# EAGLE schematic ne555n-astable (EAGLE 9.6.2)
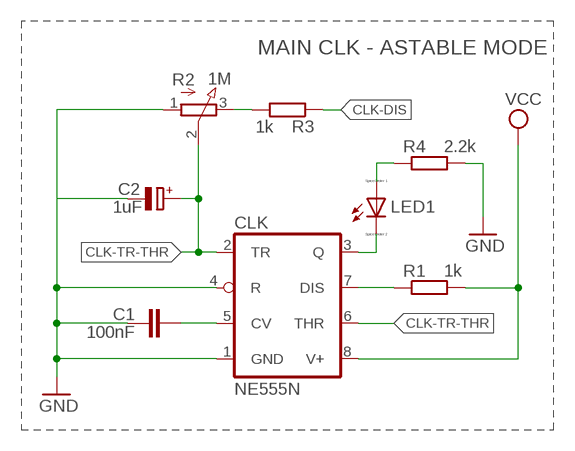
[diagram p0: schematic, sheet 1]

## Parts
C1  100nF  C-EU025-050X050  [C025-050X050]
C2  1uF  CPOL-EUE2-5  [E2-5]
CLK  NE555N  [DIL08]
LED1  LED_ELD260  [LED_LD260]
R1  1k  R-EU_0204/5  [0204/5]
R2  1M  3RP/1610N  [3RP/1610N]
R3  1k  R-EU_0204/5  [0204/5]
R4  2.2k  R-EU_0204/5  [0204/5]

## Nets
CLK-CV: C1.2 CLK.5(CV)
CLK-DIS: CLK.7(DIS) R1.1 R3.1
CLK-Q: CLK.3(Q) LED1.K(C)
CLK-TR-THR: C2.+ CLK.2(TR) CLK.6(THR) R2.2(S)
GND: C1.1 C2.- CLK.1(GND) CLK.4(R) R2.1(A) R4.2
N$2: R2.3(E) R3.2
N$4: LED1.A R4.1
VCC: CLK.8(V+) R1.2

## Notes on the sheet
- MAIN CLK - ASTABLE MODE

## Library data of the parts
C1 = resistor:C-EU: CAPACITOR, European symbol
C2 = rcl:CPOL-EU: POLARIZED CAPACITOR, European symbol; SPICEPREFIX: C
CLK = linear:*555: TIMER
LED1 = eagle-ltspice:LED_E: LED Source: http://www.osram.convergy.de Source: www.luxeon.com Source: www.kingbright.com; SPICEMODEL: NONE; SPICEPREFIX: D; SPICETYPE: diode
R1 R3 R4 = resistor:R-EU_: RESISTOR, European symbol
R2 = pot:3RP/1610N: 16mm Potentiometer one level Source: http://www.alphapotentiometers.net/html/16mm_pot_2.html